# EasyEDA schematic SCH_2ND-Try-555_2025-10-18.json
TITLE: Sheet_1; REV: 1.0; Date: 2025-10-18; Sheet: 1/1; Drawn By: osprey2370; Company: Your Company
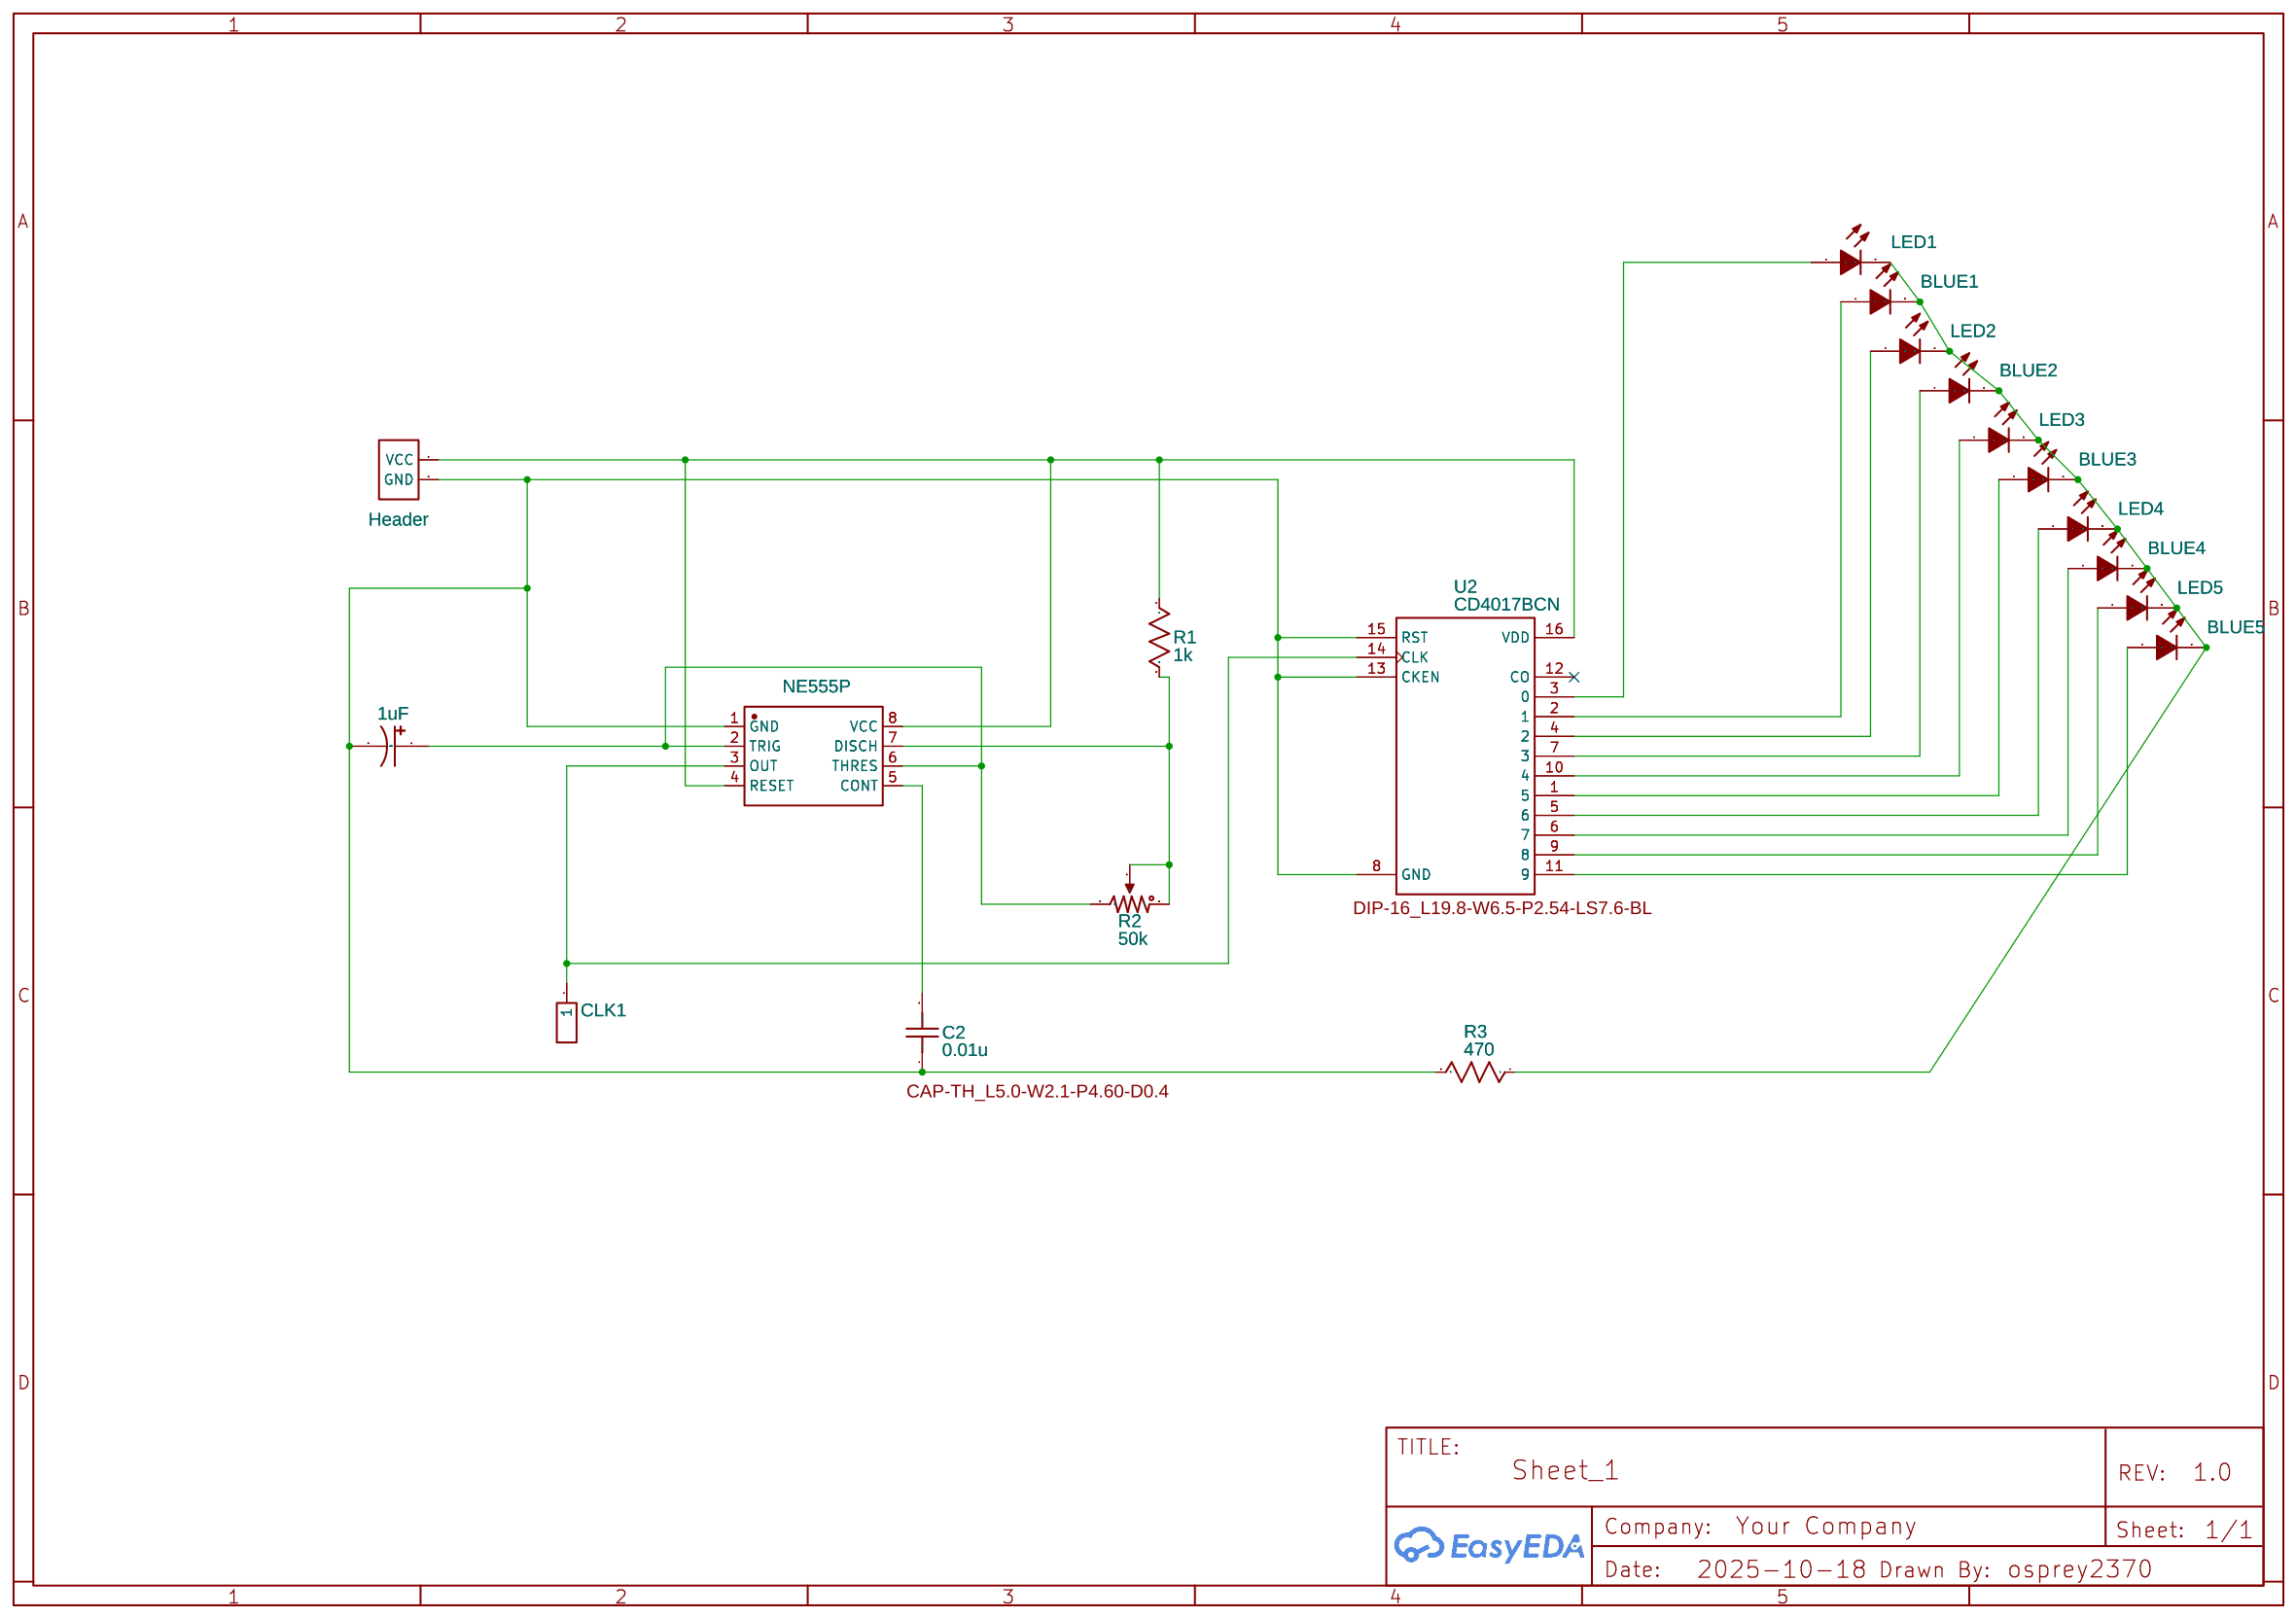
[diagram p0: schematic sheet]

## Parts
BLUE1  LED_5MM  [LED-TH_BD5.0-P2.54-FD_C9900023552]
BLUE2  LED_5MM  [LED-TH_BD5.0-P2.54-FD_C9900023552]
BLUE3  LED_5MM  [LED-TH_BD5.0-P2.54-FD_C9900023552]
BLUE4  LED_5MM  [LED-TH_BD5.0-P2.54-FD_C9900023552]
BLUE5  LED_5MM  [LED-TH_BD5.0-P2.54-FD_C9900023552]
C1  1uF  [CAP-TH_BD5.0-P2.00-D0.8-FD]
C2  0.01u  [CAP-TH_L5.0-W2.1-P4.60-D0.4]
CLK1  C81276  [HDR-TH_1P-P2.54-V-M]
H1  Header  [HDR-M-2.54_1X2]
LED1  LED_5MM  [LED-TH_BD5.0-P2.54-FD_C9900023552]
LED2  LED_5MM  [LED-TH_BD5.0-P2.54-FD_C9900023552]
LED3  LED_5MM  [LED-TH_BD5.0-P2.54-FD_C9900023552]
LED4  LED_5MM  [LED-TH_BD5.0-P2.54-FD_C9900023552]
LED5  LED_5MM  [LED-TH_BD5.0-P2.54-FD_C9900023552]
R1  1k  [R_AXIAL-0.3]
R2  50k  [RES-ADJ-3296X]
R3  470  [R_AXIAL-0.3]
U1  NE555P  [DIP-8_L9.8-W6.6-P2.54-LS7.6-BL]
U2  CD4017BCN  [DIP-16_L19.8-W6.5-P2.54-LS7.6-BL]

## Library data of the parts
BLUE1-BLUE5 = LED_5MM: Contributor: lcsc; Supplier: LCSC; Supplier Part: C473834
C1 = UVZ1H010MDD: Contributor: LCSC; Supplier: LCSC; Supplier Part: C62934; Manufacturer: Nichicon(尼吉康)
C2 = C_0603_US: Supplier Part: C249157; Supplier: LCSC; Contributor: LCEDA_Lib; Package Display: Yes
CLK1 = Header-Male-2.54_1x1: Supplier: LCSC; Manufacturer Part: 2.54-1*1P针; JLCPCB Part Class: Extended Part; Package Display: No; Manufacturer: BOOMELE(Boom Precision Elec); Contributor: Thejo Prakash
H1 = HEADER-FEMALE-2.54_1X2: Contributor: nonstop2004; Supplier: LCSC; Supplier Part: C492401; Package Display: No
LED1-LED5 = LED_5MM: Contributor: lcsc; Supplier: LCSC; Supplier Part: C2895480
R1 = Resistor: Manufacturer Part: ?; Supplier Part: C713997; Supplier: LCSC
R2 = Potentiometer: K(%): 50; Manufacturer Part: ?; Supplier: LCSC; Supplier Part: C118912; Package Display: No
R3 = Resistor: Manufacturer Part: ?; Supplier Part: C58592; Supplier: LCSC
U1 = NE555P: Supplier: LCSC; Manufacturer: TI(德州仪器); Supplier Part: C46749; JLCPCB Part Class: Extended Part
U2 = CD4017BCN: Decade CounterDivider with 10 Decoded Outputs; Supplier: LCSC; Supplier Part: C32710674; Package Display: Yes

## Nets
Net-(BLUE1-1): BLUE1.1(A) U2.2(1)
Net-(BLUE1-2): BLUE1.2(K) BLUE2.2(K) BLUE3.2(K) BLUE4.2(K) BLUE5.2(K) LED1.2(K) LED2.2(K) LED3.2(K) LED4.2(K) LED5.2(K) R3.1
Net-(BLUE2-1): BLUE2.1(A) U2.7(3)
Net-(BLUE3-1): BLUE3.1(A) U2.1(5)
Net-(BLUE4-1): BLUE4.1(A) U2.6(7)
Net-(BLUE5-1): BLUE5.1(A) U2.11(9)
Net-(C1-1): C1.1 R2.1 U1.2(TRIG) U1.6(THRES)
Net-(C1-2): C1.2 C2.1 H1.2(GND) R3.2 U1.1(GND) U2.8(GND) U2.13(CKEN) U2.15(RST)
Net-(C2-2): C2.2 U1.5(CONT)
Net-(CLK1-1): CLK1.1 U1.3(OUT) U2.14(CLK)
Net-(H1-1): H1.1(VCC) R1.1 U1.4(RESET) U1.8(VCC) U2.16(VDD)
Net-(LED1-1): LED1.1(A) U2.3(0)
Net-(LED2-1): LED2.1(A) U2.4(2)
Net-(LED3-1): LED3.1(A) U2.10(4)
Net-(LED4-1): LED4.1(A) U2.5(6)
Net-(LED5-1): LED5.1(A) U2.9(8)
Net-(R1-2): R1.2 R2.2(3) R2.3(2) U1.7(DISCH)

Not connected (* = marked no-connect by the designer): U2 12(CO)*
